# EasyEDA Pro project Schematic1.epro

# Schematic Schematic1
Board Name: Board1; Create Date: 2026-08-29; Page Name: P1; Project Name: Atmosphere module; Schematic Name: Schematic1; Update Date: 2026-08-29; Company: EasyEDA.com; Page Size: A4; Version: V1.0
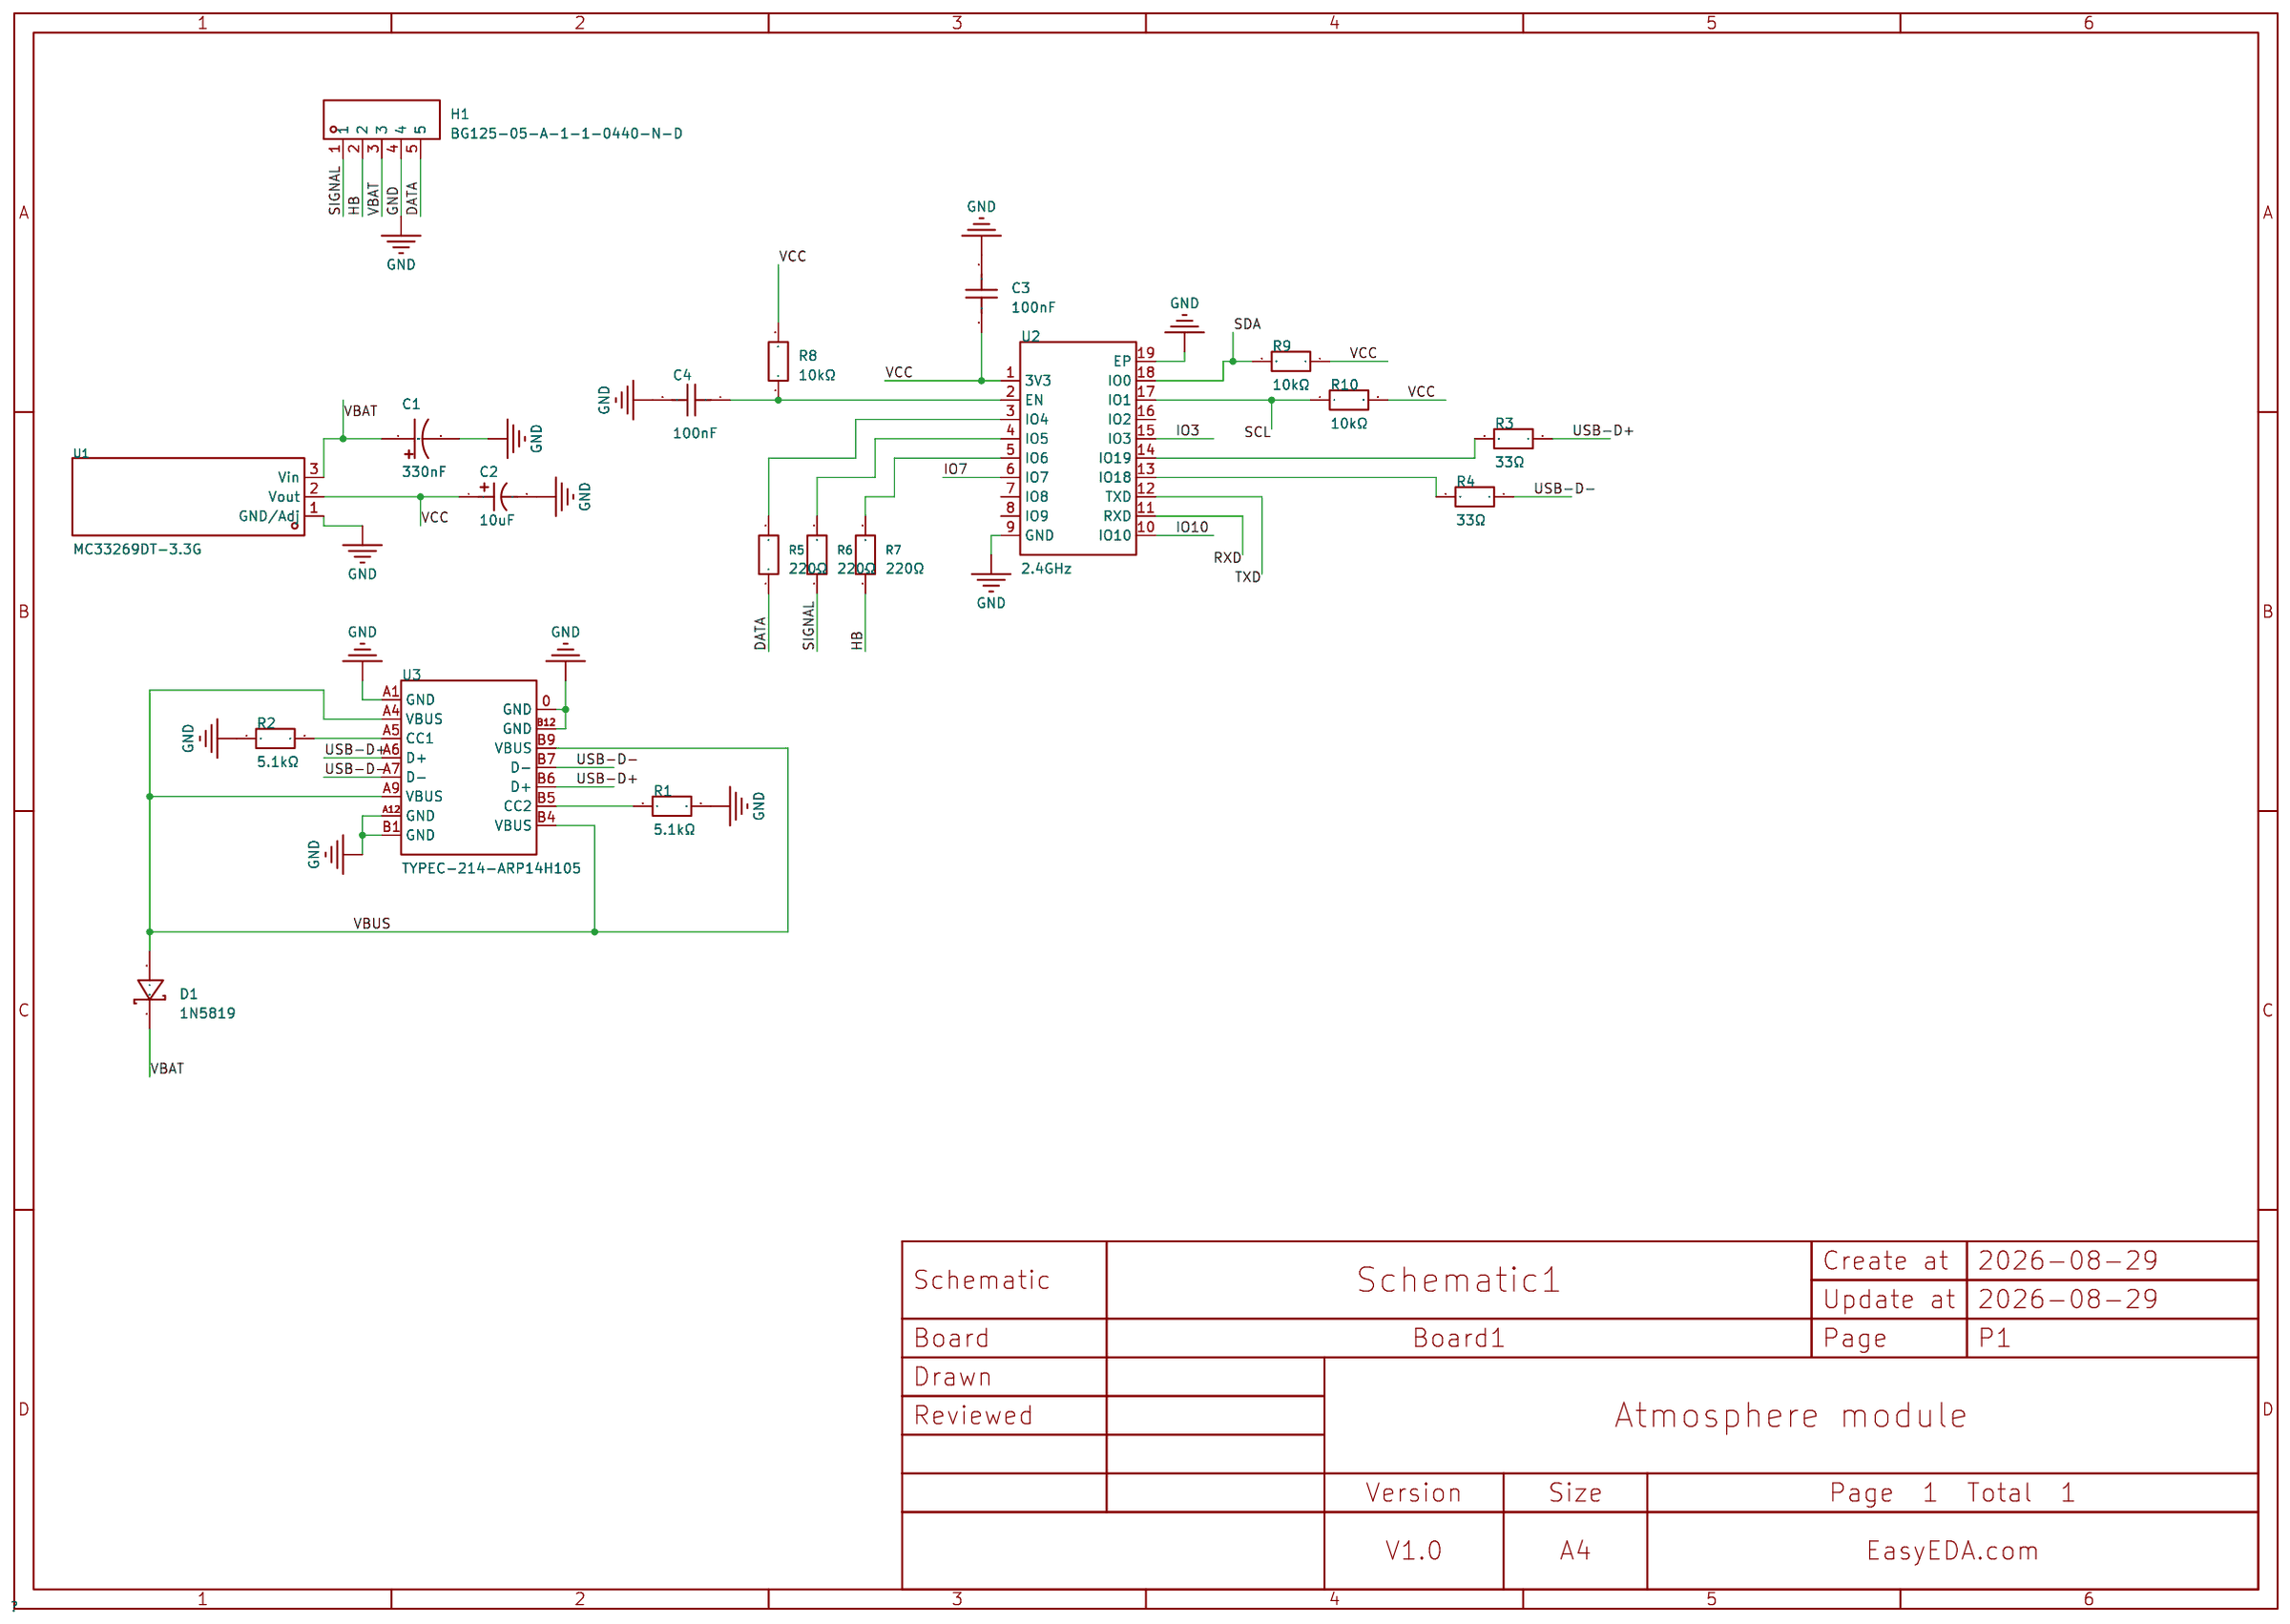
[diagram p0: schematic sheet]

## Parts
C1  330nF  [CAP-SMD_L3.2-W1.6]
C2  10uF  [CASE-A_3216]
C3  100nF  [C0805]
C4  100nF  [C0805]
D1  1N5819  [SMA_L4.4-W2.6-LS5.0-RD]
H1  BG125-05-A-1-1-0440-N-D  [HDR-SMD_5P-P2.54-V-F-LS4.4]
R1  5.1kΩ  [R0805]
R2  5.1kΩ  [R0805]
R3  33Ω  [R0805]
R4  33Ω  [R0805]
R5  220Ω  [R0805]
R6  220Ω  [R0805]
R7  220Ω  [R0805]
R8  10kΩ  [R0805]
R9  10kΩ  [R0805]
R10  10kΩ  [R0805]
U1  MC33269DT-3.3G  [TO-252-2_L6.6-W6.1-P4.57-LS9.9-BR-CW]
U2  2.4GHz  [BULETM-SMD_ESPRESSIF_ESP32-C3-WROOM-02-N4-4MB]
U3  TYPEC-214-ARP14H105  [USB-TYPE-C-TH_TYPEC-214-ARP14H105]

## Library data of the parts
C1 = T491A334K035AT: Capacitance:330nF Tolerance:±10% Tolerance:±10% Voltage Rating:35V Equivalent Series Resistance(ESR):15Ω@100kHz Operating Temperature:-55℃~+125℃ Operating Temperature:-55℃~+125℃; LCSC Part Name: 330nF ±10% 35V; Supplier Part: C212667; Manufacturer: KEMET(基美); Supplier Footprint: CASE-A-3216-18(mm); JLCPCB Part Class: Extended Part; Datasheet: https://item.szlcsc.com/datasheet/T491A334K035AT/213592.html; Supplier: LCSC; Tolerance: ±10%; Voltage Rating: 35V; Equivalent Series Resistance(ESR): 15Ω@100kHz; Operating Temperature: -55℃~+125℃
C2 = T491A106K010AT: Capacitance:10uF Tolerance:±10% Tolerance:±10% Voltage Rating:10V Current - Leakage:- Ripple Current:- Equivalent Series Resistance(ESR):3.8Ω Operating Temperature:-55℃~+125℃ Operating Temperature:-55℃~+125℃; LCSC Part Name: 10uF ±10% 10V; Supplier Part: C1508940; Manufacturer: KEMET(基美); Supplier Footprint: CASE-A-3216-18(mm); JLCPCB Part Class: Extended Part; Datasheet: https://item.szlcsc.com/datasheet/T491A106K010AT/1599380.html; Supplier: LCSC; Tolerance: ±10%; Voltage Rating: 10V; Equivalent Series Resistance(ESR): 3.8Ω; Operating Temperature: -55℃~+125℃
C3 C4 = GRM21B7U1A104JA01L: Capacitance: Tolerance:±5% Tolerance:±5% Voltage Rated: Temperature Coefficient:; LCSC Part Name: 100nF ±5% 10V; Supplier Part: C710980; Manufacturer: muRata(村田); Supplier Footprint: 0805; JLCPCB Part Class: Extended Part; Datasheet: https://atta.szlcsc.com/upload/public/pdf/source/20210128/C710980_BEF80F3D26E955AEFCD9E2DE324B32E9.pdf; Supplier: LCSC; Tolerance: ±5%
D1 = 1N5819_C437199: Diode Configuration:1 Independent Voltage - Forward(Vf@If):- Voltage - DC Reverse(Vr):40V Current - Rectified:1A Reverse Leakage Current (Ir):- Operating Junction Temperature Range:-60℃~+125℃ Operating Junction Temperature Range:-60℃~+125℃ Non-Repetitive; LCSC Part Name: KEXIN(科信)原型号 SS14,后续变更为 1N5819，丝印不变。 电压:40V 电流:1A; Supplier Part: C437199; Manufacturer: KEXIN(科信); Supplier Footprint: DO-214AC(SMA); JLCPCB Part Class: Extended Part; Datasheet: https://item.szlcsc.com/datasheet/1N5819/435098.html; Supplier: LCSC; Diode Configuration: 1 Independent; Voltage - DC Reverse(Vr): 40V; Current - Rectified: 1A; Operating Junction Temperature Range: -60℃~+125℃; Non-Repetitive Peak Forward Surge Current: 40A
H1 = BG125-05-A-1-1-0440-N-D: Holes Structure:1x5P Pitch:2.54mm Row Spacing:- Mounting Type:Surface Mount,Vertical Number of Rows:1 Number of Positions:5P Current Rating:3A Voltage Rating (Max):250V Holes Direction:Top Insulation Height:5mm Contact Material:Phosphor bronze Contact Pla; LCSC Part Name: 1x5P 间距:2.54mm 立贴; Supplier Part: C6131707; Manufacturer: GCT; Supplier Footprint: SMD,P=2.54mm; JLCPCB Part Class: Extended Part; Datasheet: https://item.szlcsc.com/datasheet/BG125-05-A-1-1-0440-N-D/7074821.html; Supplier: LCSC; Holes Structure: 1x5P; Pitch: 2.54mm; Mounting Type: Surface Mount,Vertical; Number of Rows: 1; Number of Positions: 5P; Current Rating: 3A; Voltage Rating (Max): 250V; Holes Direction: Top; Insulation Height: 5mm; Contact Material: Phosphor bronze; Contact Plating: Gold; Operating Temperature: -40℃~+105℃
R1 R2 = ERA6AEB512V: Type:Thin Film Resistor Resistance:5.1kΩ Tolerance:±0.1% Tolerance:±0.1% Power(Watts):125mW Voltage-Supply(Max):100V Temperature Coefficient:±25ppm/℃ Temperature Coefficient:±25ppm/℃ Operating Temperature:-55℃~+155℃ Operating Temperature:-55℃~+155℃; LCSC Part Name: 薄膜电阻 5.1kΩ ±0.1% 125mW; Supplier Part: C473296; Manufacturer: PANASONIC(松下); Supplier Footprint: 0805; JLCPCB Part Class: Extended Part; Datasheet: https://item.szlcsc.com/datasheet/ERA6AEB512V/479735.html; Supplier: LCSC; Type: Thin Film Resistor; Tolerance: ±0.1%; Power(Watts): 125mW; Voltage-Supply(Max): 100V; Temperature Coefficient: ±25ppm/℃; Operating Temperature: -55℃~+155℃
R3 R4 = ERJ6ENF33R0V: Type:Thick Film Resistor Resistance:33Ω Tolerance:±1% Tolerance:±1% Power(Watts):125mW Voltage-Supply(Max):- Temperature Coefficient:±100ppm/℃ Temperature Coefficient:±100ppm/℃ Operating Temperature:-55℃~+155℃ Operating Temperature:-55℃~+155℃; LCSC Part Name: 33Ω ±1% 125mW 厚膜电阻; Supplier Part: C413254; Manufacturer: PANASONIC(松下); Supplier Footprint: 0805; JLCPCB Part Class: Extended Part; Datasheet: https://item.szlcsc.com/datasheet/ERJ6ENF33R0V/405249.html; Supplier: LCSC; Type: Thick Film Resistor; Tolerance: ±1%; Power(Watts): 125mW; Temperature Coefficient: ±100ppm/℃; Operating Temperature: -55℃~+155℃
R5-R7 = ERA6AEB221V: Type:Thin Film Resistor Resistance:220Ω Tolerance:±0.1% Tolerance:±0.1% Power(Watts):125mW Voltage-Supply(Max):100V Temperature Coefficient:±25ppm/℃ Temperature Coefficient:±25ppm/℃ Operating Temperature:-55℃~+155℃ Operating Temperature:-55℃~+155℃; LCSC Part Name: 220Ω ±0.1% 125mW 薄膜电阻; Supplier Part: C445647; Manufacturer: PANASONIC(松下); Supplier Footprint: 0805; JLCPCB Part Class: Extended Part; Datasheet: https://item.szlcsc.com/datasheet/ERA6AEB221V/447234.html; Supplier: LCSC; Type: Thin Film Resistor; Tolerance: ±0.1%; Power(Watts): 125mW; Voltage-Supply(Max): 100V; Temperature Coefficient: ±25ppm/℃; Operating Temperature: -55℃~+155℃
R8-R10 = ERJP06F1002V: Type:Thick Film Resistors Resistance:10kΩ Tolerance:±1% Tolerance:±1% Power(Watts): Overload Voltage (Max):- Temperature Coefficient:±100ppm/℃ Temperature Coefficient:±100ppm/℃ Operating Temperature Range:-55℃~+155℃ Operating Temperature Range:-55℃~+155℃; LCSC Part Name: 10kΩ ±1% 500mW 厚膜电阻; Supplier Part: C543567; Manufacturer: PANASONIC(松下); Supplier Footprint: 0805; JLCPCB Part Class: Extended Part; Datasheet: https://atta.szlcsc.com/upload/public/pdf/source/20200515/C543414_D3FB4A44C151AC19BA141503575FC797.pdf; Supplier: LCSC; Type: Thick Film Resistors; Tolerance: ±1%; Temperature Coefficient: ±100ppm/℃; Operating Temperature Range: -55℃~+155℃
U1 = MC33269DT-3.3G: Output Configuration:Positive Voltage - Supply:20V Output Voltage:3.3V Output Voltage:3.3V Output Current:800mA Power Supply Rejection Ratio (PSRR):55dB@(120Hz) Voltage Dropout:1V@(500mA) standby current:5.5mA Noise:- Features:Thermal shutdown；Over Curren; LCSC Part Name: 3.3V 800mA 20V; Supplier Part: C232419; Manufacturer: onsemi(安森美); Supplier Footprint: TO-252-2(DPAK); JLCPCB Part Class: Extended Part; Datasheet: https://item.szlcsc.com/datasheet/MC33269DT-3.3G/232277.html; Supplier: LCSC; Output Configuration: Positive; Voltage - Supply: 20V; Output Voltage: 3.3V; Output Current: 800mA; Power Supply Rejection Ratio (PSRR): 55dB@(120Hz); Voltage Dropout: 1V@(500mA); standby current: 5.5mA; Features: Thermal shutdown；Over Current Protection；Short Circuit Protection; Operating Temperature: -40℃~+125℃@(Ta); Output Type: Fixed; Number of Outputs: 1
U2 = ESP32-C3-WROOM-02-N4_C2934560: Utilized IC / Part:ESP32-C3 Chip Wireless Standard:Bluetooth5.0 Interface Type:I2S；I2C；JTAG；UART；USB；SPI Frequency:2.4GHz Antenna Type:On-board PCB Antenna Output Power:20.5dBm Output Power:20.5dBm Voltage - Supply:3V~3.6V Voltage - Supply:3V~3.6V Receive; LCSC Part Name: 不带固件 2.4GHz Wi-Fi（802.11b/g/n）+ 蓝牙5模组; Supplier Part: C2934560; Manufacturer: ESPRESSIF(乐鑫); Manufacturer Part: ESP32-C3-WROOM-02-N4; Supplier Footprint: SMD,20x18mm; JLCPCB Part Class: Extended Part; Datasheet: https://item.szlcsc.com/datasheet/ESP32-C3-WROOM-02-N4/3281215.html; Supplier: LCSC; Utilized IC / Part: ESP32-C3 Chip; Wireless Standard: Bluetooth5.0; Interface Type: I2S；I2C；JTAG；UART；USB；SPI; Antenna Type: On-board PCB Antenna; Output Power: 20.5dBm; Voltage - Supply: 3V~3.6V; Receive  Current: 82mA; Send  Current: 345mA; Sensitivity: -105dBm; Operating Temperature: -40℃~+85℃; Features: Integrated Bluetooth function；Support USB interface
U3 = TYPEC-214-ARP14H105: Connector Type:Type-C Protocol Standard:- Gender:Female Mounting Type:Through Hole Number of Contacts:14P Number of Ports:1 Current Rating-Power:5A Voltage Rating:20V Connect-Disconnect Life:10000 times Length:10.5mm Detection color:Black Operating Temper; LCSC Part Name: Type-C 母 直插; Supplier Part: C2982529; Manufacturer: XUNPU(讯普); Supplier Footprint: 插件; JLCPCB Part Class: Extended Part; Datasheet: https://item.szlcsc.com/datasheet/TYPEC-214-ARP14H105/3412791.html; Supplier: LCSC; Connector Type: Type-C; Gender: Female; Mounting Type: Through Hole; Number of Contacts: 14P; Number of Ports: 1; Current Rating-Power: 5A; Voltage Rating: 20V; Connect-Disconnect Life: 10000 times; Length: 10.5mm; Detection color: Black; Operating Temperature: -40℃~+85℃

## Nets
GND: C1.2 C2.2 C3.1 C4.2 H1.4 R1.2 R2.1 U1.1(GND/Adj) U2.9(GND) U2.19(EP) U3.0(GND) U3.A1(GND) U3.A12(GND) U3.B1(GND) U3.B12(GND)
VBAT: C1.1 D1.1(C) H1.3 U1.3(Vin)
VBUS: D1.2(A) U3.A4(VBUS) U3.A9(VBUS) U3.B4(VBUS) U3.B9(VBUS)
VCC: C2.1 C3.2 R8.2 R9.1 R10.2 U1.2(Vout) U2.1(3V3)
DATA: H1.5 R5.1
HB: H1.2 R7.1
IO3: U2.15(IO3)
IO7: U2.6(IO7)
IO10: U2.10(IO10)
RXD: U2.11(RXD)
SCL: R10.1 U2.17(IO1)
SDA: R9.2 U2.18(IO0)
SIGNAL: H1.1 R6.1
TXD: U2.12(TXD)
USB-D+: R3.1 U3.A6(D+) U3.B6(D+)
USB-D-: R4.1 U3.A7(D-) U3.B7(D-)
Net-(C4-1): C4.1 R8.1 U2.2(EN)
Net-(R1-1): R1.1 U3.B5(CC2)
Net-(R2-2): R2.2 U3.A5(CC1)
Net-(R3-2): R3.2 U2.14(IO19)
Net-(R4-2): R4.2 U2.13(IO18)
Net-(R5-2): R5.2 U2.3(IO4)
Net-(R6-2): R6.2 U2.4(IO5)
Net-(R7-2): R7.2 U2.5(IO6)

Not connected (* = marked no-connect by the designer): U2 7(IO8) 8(IO9) 16(IO2)
